# Altium schematic sheet UserInputs.SchDoc
size A; SheetNumber: 2; SheetTotal: 5
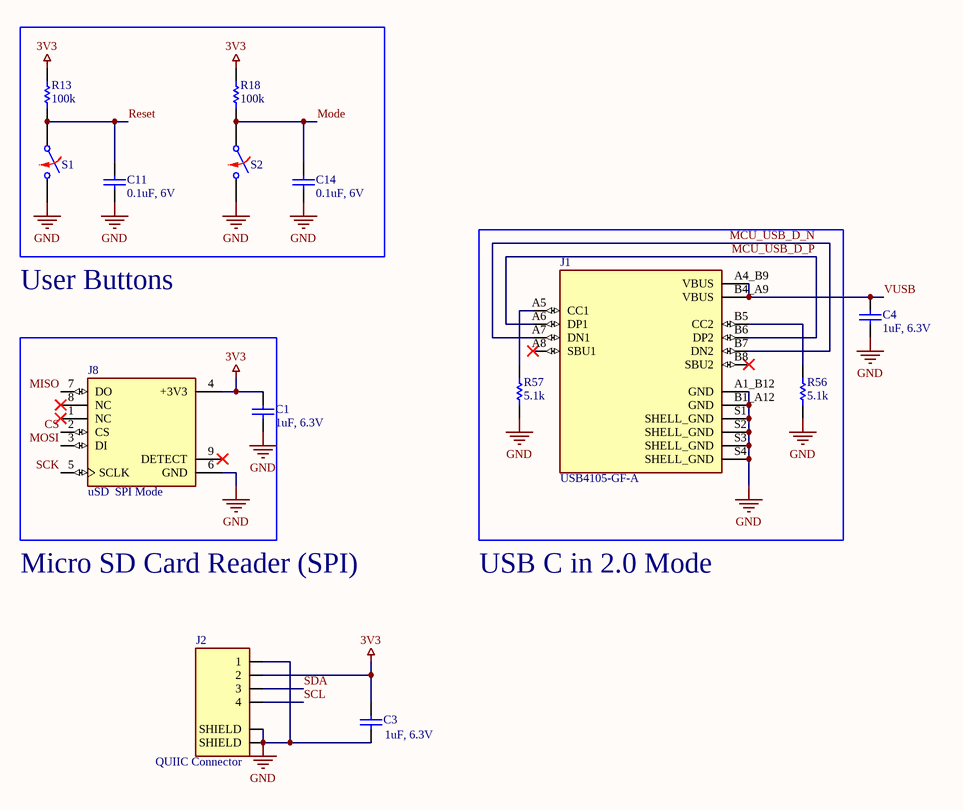
[diagram p0: UserInputs.SchDoc]

## Parts
C1  value 1uF, 6.3V  [ANTC1608X90N]  (hidden comment: Capacitor)
C3  value 1uF, 6.3V  [ANTC1608X90N]  (hidden comment: Capacitor)
C4  value 1uF, 6.3V  [ANTC1608X90N]  (hidden comment: Capacitor)
C11  value 0.1uF, 6V  [ANTC1608X90N]  (hidden comment: Capacitor)
C14  value 0.1uF, 6V  [ANTC1608X90N]  (hidden comment: Capacitor)
J1  USB4105-GF-A  [GCT_USB4105-GF-A]
J2  QUIIC Connector  [JST_SM04B-SRSS-TB(LF)(SN)]
J8  uSD  SPI Mode  [GCT_MEM2051-00-195-00-A]
R13  value 100k  [0603 Resistor]  (hidden comment: Resistor)
R18  value 100k  [0603 Resistor]  (hidden comment: Resistor)
R56  value 5.1k  [0603 Resistor]  (hidden comment: Resistor)
R57  value 5.1k  [0603 Resistor]  (hidden comment: Resistor)
S1  Switch Normally Opened  [TL3313AF250QG]  (value not drawn)
S2  Switch Normally Opened  [TL3313AF250QG]  (value not drawn)

## Nets
3V3: C1.2 C3.2 J2.2 J8.4(+3V3) R13.2 R18.2
GND: C1.1 C3.1 C4.1 C11.1 C14.1 J1.A1_B12(GND) J1.B1_A12(GND) J1.S1(SHELL_GND) J1.S2(SHELL_GND) J1.S3(SHELL_GND) J1.S4(SHELL_GND) J2.1 J2.S1(SHIELD) J2.S2(SHIELD) J8.6(GND) R56.1 R57.1 S1.2 S2.2
CS: J8.2(CS)
MCU_USB_D_N: J1.A7(DN1) J1.B7(DN2)
MCU_USB_D_P: J1.A6(DP1) J1.B6(DP2)
MISO: J8.7(DO)
Mode: C14.2 R18.1 S2.1
MOSI: J8.3(DI)
Reset: C11.2 R13.1 S1.1
SCK: J8.5(SCLK)
SCL: J2.4
SDA: J2.3
VUSB: C4.2 J1.A4_B9(VBUS) J1.B4_A9(VBUS)
NetJ1_A5: J1.A5(CC1) R57.2
NetJ1_B5: J1.B5(CC2) R56.2

Not connected (* = marked no-connect by the designer): J1 A8(SBU1)* B8(SBU2)*; J8 1(NC)* 8(NC)* 9(DETECT)*

## Notes on the sheet
- User Buttons
- Micro SD Card Reader (SPI)
- USB C in 2.0 Mode

## Library data of the parts
C1 C3 C4 C11 C14 = Capacitor: SimulationGenericComponent: True
J1 = USB4105-GF-A: USB-C (USB TYPE-C) USB 2.0 Receptacle Connector 24 (16+8 Dummy) Position Surface Mount, Right Angle; Through Hole; Value: *; Availability: Unavailable; Price: None; Package: None; MP: USB4105-GF-A
J2 = SM04B-SRSS-TB(LF)(SN): SH Series 1.0 mm Pitch 2 Position Single Row Side Entry Shrouded Header; Value: *; Availability: Unavailable; Price: None; Package: None; MP: SM04B-SRSS-TB(LF)(SN)
J8 = MEM2051-00-195-00-A: 9 (8 + 1) Position Card Connector microSDâ„¢ Surface Mount, Right Angle Gold, 1.95mm profile, Normally open switch, Push push, Top mount; MF: Global Connector Technology; Purchase-URL: https://pricing.snapeda.com/search/part/MEM2051-00-195-00-A/?ref=eda; Price: None; SnapEDA_Link: https://www.snapeda.com/parts/MEM2051-00-195-00-A/Global%20Connector%20Technology/view-part/779220/?ref=snap; Check_prices: https://www.snapeda.com/parts/MEM2051-00-195-00-A/Global%20Connector%20Technology/view-part/779220/?ref=eda; Package: None; MP: MEM2051-00-195-00-A; Value: *; Availability: Warning
R13 R18 R56 R57 = Resistor: TC1: 0; SimulationGenericComponent: True; TC2: 0
S1 S2 = SW NO: closed: 0; Rclosed: 1m; Ropen: 1Meg; SimulationGenericComponent: True